# EAGLE schematic lm3410-sepic-led-driver-15mm-mk-1 (EAGLE 6.4)
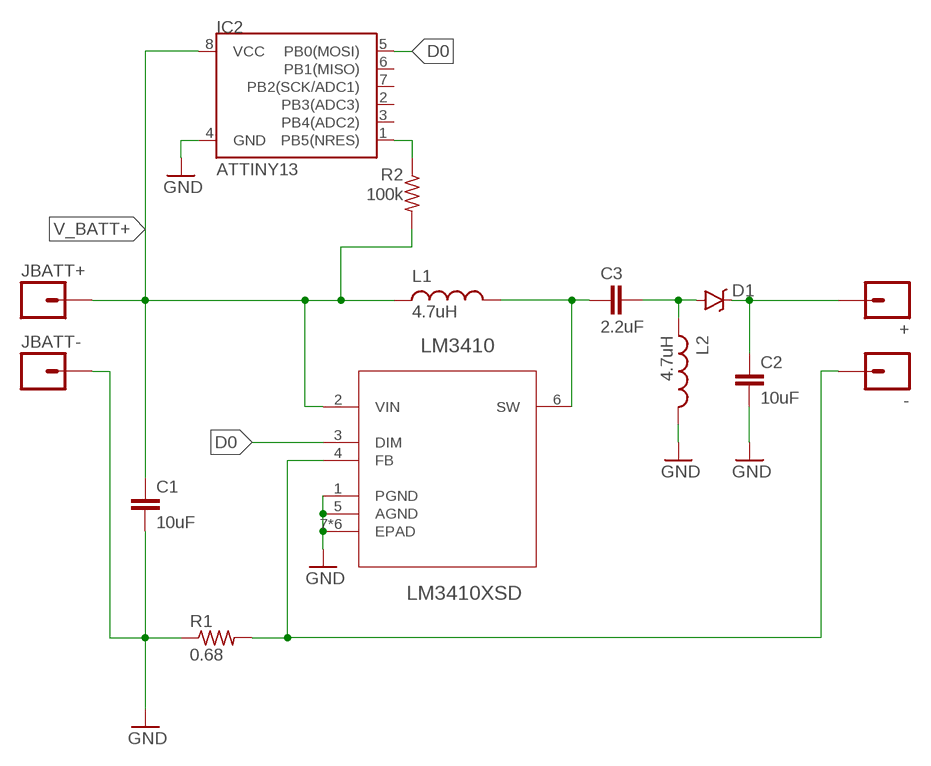
[diagram p0: schematic, sheet 1]

## Parts
+  M01PTH-KIT  [1X01-KIT]
-  M01NOSILK-KIT  [1X01NS-KIT]
C1  10uF  CAPACITOR-CERAMICC0603  [C0603]
C2  10uF  CAPACITOR-CERAMICC0603  [C0603]
C3  2.2uF  CAPACITOR-CERAMICC0805  [C0805]
D1  BAT20J  DIODE-SCHOTTKYBAT20J  [SOD-323]
IC2  ATTINY13  ATTINY13SOIC  [SO08]
JBATT+  M01NOT-A-VIA-NOPE  [1X01_NOSILK_NOSTOP]
JBATT-  M01NOT-A-VIA-NOPE  [1X01_NOSILK_NOSTOP]
L1  4.7uH  INDUCTORIFSC-0806  [INDUCTOR_2X1.6MM]
L2  4.7uH  INDUCTORIFSC-0806  [INDUCTOR_2X1.6MM]
LM3410  LM3410XSD  [DFN300X300X80-7N]
R1  0.68  RESISTORR1206  [R1206]
R2  100k  RESISTORR0402  [R0402]

## Nets
D0: IC2.5(PB0(MOSI)) LM3410.3(DIM)
GND: C1.2 C2.2 IC2.4(GND) JBATT-.P$1 L2.P$2 LM3410.1(PGND) LM3410.5(AGND) LM3410.7(EPAD) LM3410.7@1(EPAD) LM3410.7@2(EPAD) LM3410.7@3(EPAD) LM3410.7@4(EPAD) LM3410.7@5(EPAD) R1.1
LED_ANODE: +.1 C2.1 D1.C
N$1: C3.2 D1.A L2.P$1
N$3: IC2.1(PB5(NRES)) R2.1
N$6: -.1 LM3410.4(FB) R1.2
SW: C3.1 L1.P$2 LM3410.6(SW)
V_BATT+: C1.1 IC2.8(VCC) JBATT+.P$1 L1.P$1 LM3410.2(VIN) R2.2
Unconnected: IC2.2(PB3(ADC3)) IC2.3(PB4(ADC2)) IC2.6(PB1(MISO)) IC2.7(PB2(SCK/ADC1))

## Library data of the parts
+ - JBATT+ JBATT- = A_butts:M01: Header 1 Standard 1-pin 0.1" header. Use with straight break away headers (SKU : PRT-00116), right angle break away headers (PRT-00553), swiss pins (PRT-00743), machine pins (PRT-00117), and female headers (PRT-00115).
C1-C3 = A_butts:CAPACITOR-CERAMIC: CAPACITOR, European symbol
D1 = A_butts:DIODE-SCHOTTKY: Schottky diodes in SFE's production catalog BAT20J 1A 23V 0.62Vf RB751 120mA 40V 0.37Vf PMEG4005EJ 0.5A 40V 0.42Vf MBRA140 1A 40V 0.5Vf B340A 3A 40V SMA; PROD_ID: DIO-11623
IC2 = A_butts:ATTINY13: Atmel 8-pin 1kB flash uC
L1 L2 = A_butts:INDUCTOR: Inductors Basic Inductor/Choke - 0603 and 1206. Footprints are not proven and vary greatly between part numbers. SRN6045- 33uH, 20% 1.4A SDR0403-560KL - 56uH, 10%, 500mA RMS/740mA peak
LM3410 = A_butts:LM3410XSD: Constant Current Boost and SEPIC LED Driver; MPN: LM3410XSD; OC_FARNELL: -; OC_NEWARK: 11N9218; PACKAGE: DFN-6; SUPPLIER: National Semiconductor
R1 R2 = A_butts:RESISTOR: RESISTOR, American symbol